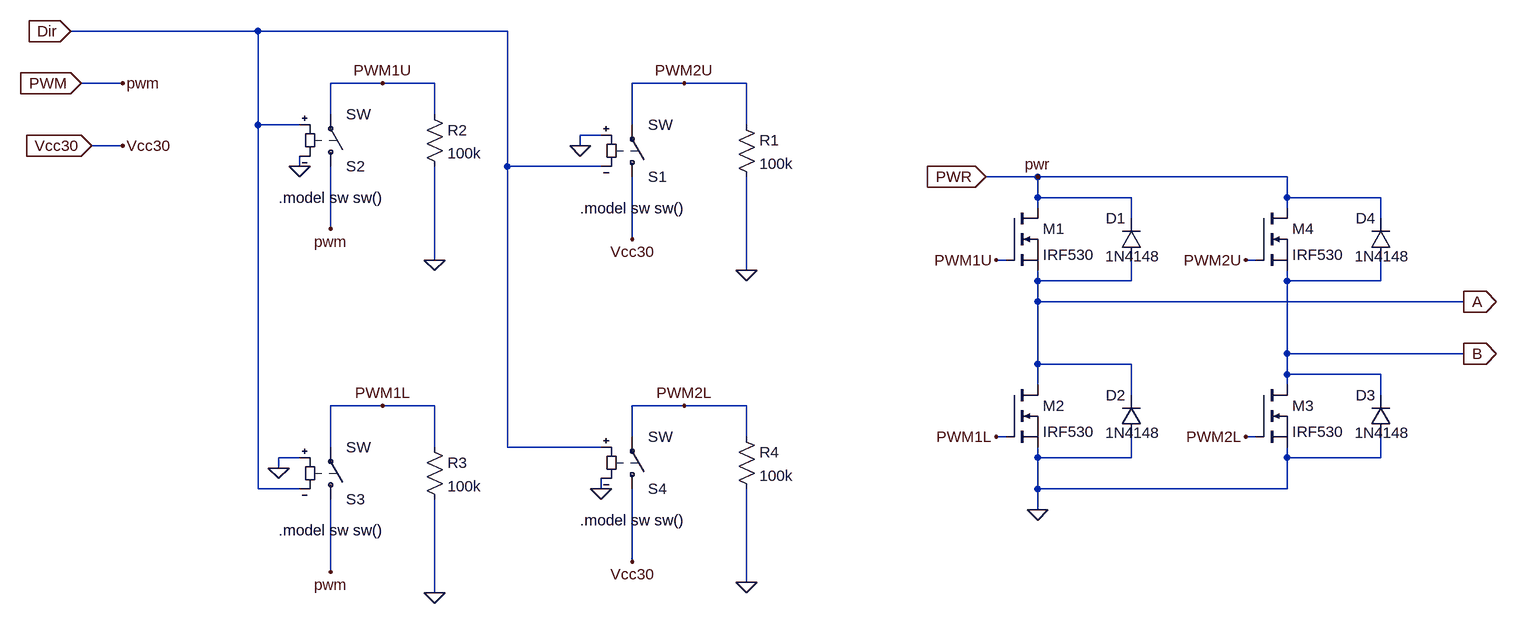
[diagram p0: schematic full_bridge.asc]
full_bridge.asc, the LTspice schematic file:
Version 4
SHEET 1 1148 1080
WIRE -864 -320 -1152 -320
WIRE -480 -320 -864 -320
WIRE -1072 -240 -1136 -240
WIRE -672 -240 -752 -240
WIRE -592 -240 -672 -240
WIRE -208 -240 -288 -240
WIRE -112 -240 -208 -240
WIRE -752 -192 -752 -240
WIRE -592 -192 -592 -240
WIRE -864 -176 -864 -320
WIRE -800 -176 -864 -176
WIRE -288 -176 -288 -240
WIRE -112 -176 -112 -240
WIRE -336 -160 -368 -160
WIRE -1072 -144 -1120 -144
WIRE -368 -144 -368 -160
WIRE -800 -112 -800 -128
WIRE -480 -112 -480 -320
WIRE -336 -112 -480 -112
WIRE 336 -96 256 -96
WIRE 720 -96 336 -96
WIRE 336 -64 336 -96
WIRE 480 -64 336 -64
WIRE 720 -64 720 -96
WIRE 864 -64 720 -64
WIRE 336 -48 336 -64
WIRE 720 -48 720 -64
WIRE 480 -32 480 -64
WIRE 864 -32 864 -64
WIRE -752 -16 -752 -112
WIRE -288 0 -288 -96
WIRE -592 32 -592 -112
WIRE 288 32 272 32
WIRE 672 32 656 32
WIRE -112 48 -112 -96
WIRE 336 64 336 48
WIRE 480 64 480 32
WIRE 480 64 336 64
WIRE 720 64 720 48
WIRE 864 64 864 32
WIRE 864 64 720 64
WIRE 336 96 336 64
WIRE 992 96 336 96
WIRE 720 176 720 64
WIRE 992 176 720 176
WIRE 336 192 336 96
WIRE 480 192 336 192
WIRE 720 208 720 176
WIRE 864 208 720 208
WIRE 336 224 336 192
WIRE 720 224 720 208
WIRE 480 240 480 192
WIRE 864 240 864 208
WIRE -672 256 -752 256
WIRE -592 256 -672 256
WIRE -208 256 -288 256
WIRE -112 256 -208 256
WIRE -288 304 -288 256
WIRE -112 304 -112 256
WIRE 288 304 272 304
WIRE 672 304 656 304
WIRE -752 320 -752 256
WIRE -592 320 -592 256
WIRE -480 320 -480 -112
WIRE -336 320 -480 320
WIRE -800 336 -832 336
WIRE 336 336 336 320
WIRE 480 336 480 304
WIRE 480 336 336 336
WIRE 720 336 720 320
WIRE 864 336 864 304
WIRE 864 336 720 336
WIRE -832 352 -832 336
WIRE -864 384 -864 -176
WIRE -800 384 -864 384
WIRE -336 384 -336 368
WIRE 336 384 336 336
WIRE 720 384 720 336
WIRE 720 384 336 384
WIRE 336 416 336 384
WIRE -288 496 -288 384
WIRE -752 512 -752 400
WIRE -112 528 -112 384
WIRE -592 544 -592 400
FLAG 336 416 0
FLAG 272 304 PWM1L
FLAG 656 304 PWM2L
FLAG 992 96 A
IOPIN 992 96 Out
FLAG 992 176 B
IOPIN 992 176 Out
FLAG 656 32 PWM2U
FLAG -112 48 0
FLAG -208 -240 PWM2U
FLAG -800 -112 0
FLAG -592 32 0
FLAG -672 -240 PWM1U
FLAG -592 544 0
FLAG -672 256 PWM1L
FLAG -336 384 0
FLAG -112 528 0
FLAG -208 256 PWM2L
FLAG 272 32 PWM1U
FLAG -368 -144 0
FLAG -832 352 0
FLAG -1136 -240 PWM
IOPIN -1136 -240 In
FLAG -1152 -320 Dir
IOPIN -1152 -320 In
FLAG 256 -96 PWR
IOPIN 256 -96 In
FLAG 336 -96 pwr
FLAG -1120 -144 Vcc30
IOPIN -1120 -144 In
FLAG -1072 -144 Vcc30
FLAG -1072 -240 pwm
FLAG -752 512 pwm
FLAG -288 496 Vcc30
FLAG -752 -16 pwm
FLAG -288 0 Vcc30
SYMBOL nmos 288 224 R0
SYMATTR InstName M2
SYMATTR Value IRF530
SYMBOL nmos 672 224 R0
SYMATTR InstName M3
SYMATTR Value IRF530
SYMBOL diode 496 32 R180
WINDOW 0 24 64 Left 2
WINDOW 3 -29 6 Left 2
SYMATTR InstName D1
SYMATTR Value 1N4148
SYMBOL sw -288 -80 M180
SYMATTR InstName S1
SYMBOL res -128 -192 R0
SYMATTR InstName R1
SYMATTR Value 100k
SYMBOL sw -752 -96 M180
SYMATTR InstName S2
SYMBOL res -608 -208 R0
SYMATTR InstName R2
SYMATTR Value 100k
SYMBOL sw -752 416 M180
SYMATTR InstName S3
SYMBOL res -608 304 R0
SYMATTR InstName R3
SYMATTR Value 100k
SYMBOL sw -288 400 M180
SYMATTR InstName S4
SYMBOL res -128 288 R0
SYMATTR InstName R4
SYMATTR Value 100k
SYMBOL nmos 288 -48 R0
SYMATTR InstName M1
SYMATTR Value IRF530
SYMBOL nmos 672 -48 R0
SYMATTR InstName M4
SYMATTR Value IRF530
SYMBOL diode 496 304 R180
WINDOW 0 24 64 Left 2
WINDOW 3 -29 6 Left 2
SYMATTR InstName D2
SYMATTR Value 1N4148
SYMBOL diode 880 304 R180
WINDOW 0 24 64 Left 2
WINDOW 3 -29 6 Left 2
SYMATTR InstName D3
SYMATTR Value 1N4148
SYMBOL diode 880 32 R180
WINDOW 0 24 64 Left 2
WINDOW 3 -29 6 Left 2
SYMATTR InstName D4
SYMATTR Value 1N4148
TEXT -368 -48 Left 2 !.model sw sw()
TEXT -832 -64 Left 2 !.model sw sw()
TEXT -832 448 Left 2 !.model sw sw()
TEXT -368 432 Left 2 !.model sw sw()

The netlist it stands for:
* full_bridge.asc
M2 A PWM1L 0 0 IRF530
M3 B PWM2L 0 0 IRF530
D1 A PWR 1N4148
S1 Vcc30 PWM2U 0 Dir SW
R1 PWM2U 0 100k
S2 PWM PWM1U Dir 0 SW
R2 PWM1U 0 100k
S3 PWM PWM1L 0 Dir SW
R3 PWM1L 0 100k
S4 Vcc30 PWM2L Dir 0 SW
R4 PWM2L 0 100k
M1 PWR PWM1U A A IRF530
M4 PWR PWM2U B B IRF530
D2 0 A 1N4148
D3 0 B 1N4148
D4 B PWR 1N4148
.model D D
.lib standard.dio
.model NMOS NMOS
.model PMOS PMOS
.lib standard.mos
.model sw sw()
.model sw sw()
.model sw sw()
.model sw sw()
.backanno
.end